# Altium project PCB_Project.PrjPcb
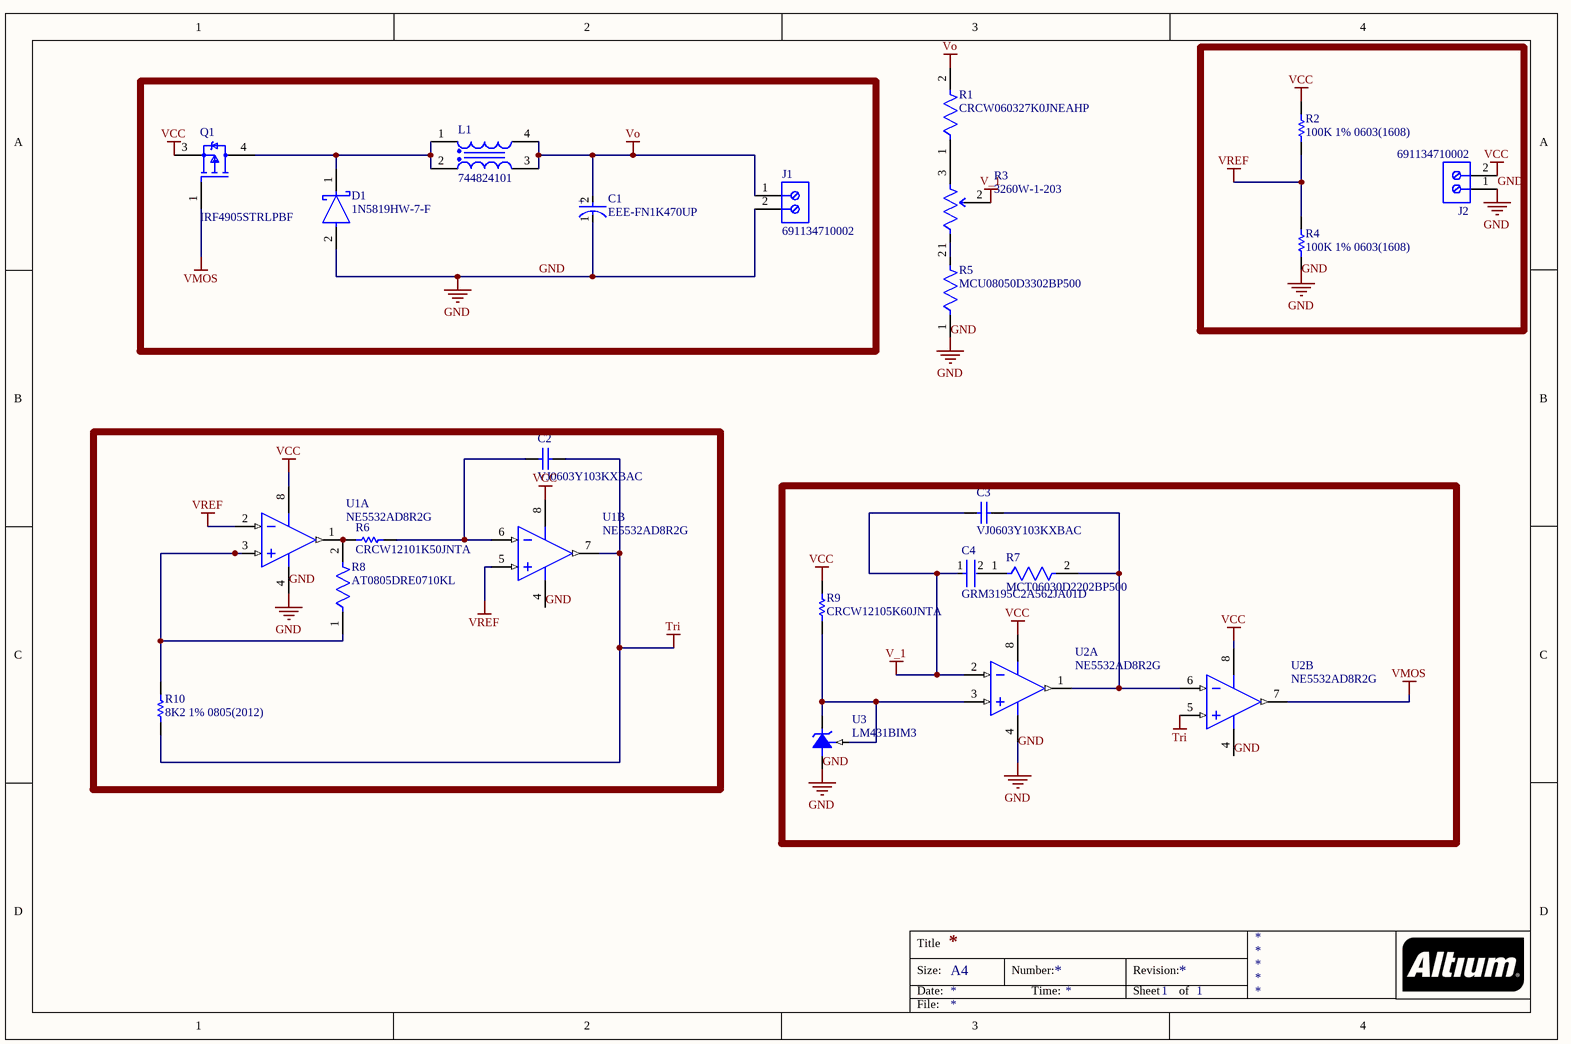
[diagram p0: Sheet1.SchDoc]
1 sheet, 22 parts. Net scope: global (net labels, ports and power ports of the same name join across sheets).
Board file: PCB1.PcbDoc

## Sheet Sheet1.SchDoc
size A4; Author: Senuda Ratnayake; SheetNumber: 1; SheetTotal: 1

### Parts
C1  EEE-FN1K470UP  [FP-FNF-MFG]
C2  VJ0603Y103KXBAC  [CAPC1608X92X38NL15T08]
C3  VJ0603Y103KXBAC  [CAPC1608X92X38NL15T08]
C4  GRM3195C2A562JA01D  [FP-GRM319-0_15-IPC_A]
D1  1N5819HW-7-F  [FP-SOD123-IPC_A]
J1  691134710002  [691134710002]
J2  691134710002  [691134710002]
L1  744824101  [WE-CMB_Type L_L27.5W18.5H33]
Q1  IRF4905STRLPBF  [FP-PG-TO263-3-MFG]
R1  CRCW060327K0JNEAHP  [FP-CRCW0603-HPe3-IPC_B]
R2  100K 1% 0603(1608)  [RESC0603(1608)_N]
R3  3260W-1-203  [FP-3260W-MFG]
R4  100K 1% 0603(1608)  [RESC0603(1608)_N]
R5  MCU08050D3302BP500  [FP-MCU0805-IPC_A]
R6  CRCW12101K50JNTA  [RESC3225X60X45NL20T20]
R7  MCT06030D2202BP500  [FP-MCT0603-IPC_A]
R8  AT0805DRE0710KL  [FP-AT0805-MFG]
R9  CRCW12105K60JNTA  [RESC3225X60X45LL20T20]
R10  8K2 1% 0805(2012)  [RESC0805(2012)_N]
U1  NE5532AD8R2G  [ONSC-SOIC-8-751-07_V]  (parts A,B of 2)
U2  NE5532AD8R2G  [ONSC-SOIC-8-751-07_V]  (parts A,B of 2)
U3  LM431BIM3  [DBZ0003A_M]

### Nets
GND: C1.1(C) D1.2(A) J1.2 J2.1 R4.1 R5.1 U1.4(V-) U2.4(V-) U3.3(A)
Tri: C2.2 R10.1 U1.7(OUTB) U2.5(INB+)
V_1: C3.1 C4.1 R3.2(WIPER) U2.2(INA-)
VCC: J2.2 Q1.3(S) R2.2 R9.2 U1.8(V+) U2.8(V+)
VMOS: Q1.1(G) U2.7(OUTB)
Vo: C1.2(A) J1.1 L1.3 L1.4 R1.2
VREF: R2.1 R4.2 U1.2(INA-) U1.5(INB+)
NetC2_1: C2.1 R6.2 U1.6(INB-)
NetC3_2: C3.2 R7.2 U2.1(OUTA) U2.6(INB-)
NetC4_2: C4.2 R7.1
NetD1_1: D1.1(C) L1.1 L1.2 Q1.4(D)
NetR1_1: R1.1 R3.3(CW)
NetR3_1: R3.1(CCW) R5.2
NetR6_1: R6.1 R8.2 U1.1(OUTA)
NetR8_1: R8.1 R10.2 U1.3(INA+)
NetR9_1: R9.1 U2.3(INA+) U3.1(K) U3.2(REF)

### Notes on the sheet
- Labels drawn without touching a wire or pin: GND
- Title
- Size:
- Date:
- A4
- Number:
- Time:
- Revision:
- Sheet
- of
- File:
- (in symbol CMP-05427-000046-1) +

### Library data of the parts
C1 = CMP-05427-000046-1: CAP ALUM 47UF 20% 80V SMD
C2 C3 = CMP-2006-01186-1: Manufacturer: Vitramon; Part Number: VJ0603Y103KXBAC
C4 = CMP-1037-03218-2: Chip Multilayer Ceramic Capacitors for General Purpose, 1206, 5600pF, C0G, 30ppm/°C, 5%, 100V; Capacitance: 5.6nF; Width: 1.6mm; Tolerance: 5%; Length: 3.2mm; Case/Package: 1206; Height: 0.85mm; Radiation Hardening: No; Voltage Rating: 100V; Mount: Surface Mount; Thickness: 0.037inch; Case Code (Metric): 3216; Lead Free: Lead Free; Case Code (Imperial): 1206; Voltage Rating (DC): 100V; Termination: SMD/SMT; Min Operating Temperature: -55°C; Package Quantity: 4000; Max Operating Temperature: 125°C; Dielectric: C0G; Packaging: Tape and Reel; Depth: 1.6mm
D1 = CMP-0303-00003-3: DIODE SCHOTTKY 40V 1A SOD123; Forward Voltage: 450mV; Capacitance: 110pF; Max Forward Surge Current (Ifsm): 25A; Peak Reverse Current: 50uA; Polarity: Standard; Element Configuration: Single; Max Power Dissipation: 450mW; Min Operating Temperature: -65°C; Package Quantity: 3000; Contact Plating: Tin; Weight: 0.000353oz; Max Repetitive Reverse Voltage (Vrrm): 40V; Max Reverse Voltage (DC): 40V; Height: 1.25mm; Average Rectified Current: 1A; Width: 1.7mm; Case/Package: SOD-123-2; Lead Free: Lead Free; Max Operating Temperature: 125°C; Current Rating: 1A; Termination: SMD/SMT; Forward Current: 1A; Radiation Hardening: No; Number of Pins: 2; Length: 2.85mm; Voltage Rating (DC): 40V; REACH SVHC: No SVHC; Peak Non-Repetitive Surge Current: 25A; Packaging: Tape and Reel; Output Current: 1A
J1 J2 = CMP-1502-03295-3: Wire-To-Board Terminal Block, 5mm Pitch, Horizontal, Screw, 2 Poles
L1 = CMP-0223-00095-2: NexarPartId: 22862926; Inductance: 1mH; Inductance Tolerance: 30%; Resistance: 7mΩ; RoHS: Compliant; Packaging: Bulk; Number of Pins: 4
Q1 = CMP-32901-000610-1: MOSFET P-CH 55V 42A D2PAK; Max Dual Supply Voltage: -55V; Max Power Dissipation: 170W; Rds On Max: 20mR; Input Capacitance: 3.5nF; Threshold Voltage: 4V; RoHS Compliant: Yes; Packaging: Tape and Reel; REACH SVHC: No SVHC; Continuous Drain Current (ID): 42A; Mount: Surface Mount; Drain to Source Voltage (Vdss): -55V; Max Operating Temperature: 150°C; Number of Pins: 3; Lead Free: Contains Lead; Case/Package: TO-263-3; Min Operating Temperature: -55°C; Halogen Free: Halogen Free
R1 = CMP-02407-002948-1: RES Thick Film, 27kΩ, 5%, 0.33W, 200ppm/°C, 0603; Resistance: 27kR; Max Power Dissipation: 250mW; Composition: Thick Film; Length: 0.063inch; Packaging: Tape and Reel; Features: Automotive AEC-Q200; Case/Package: 0603; Temperature Coefficient: 200ppm/°C; Number of Terminations: 2; Lead Free: Lead Free; Height: 0.022inch; Tolerance: 5%; Width: 0.033inch; Package Quantity: 5000
R2 R4 = CMP-1012-00736-1: 100K 0.1W 1% 0603 (1608 Metric)  SMD; Value: 100000.00 Ohm; Case-Metric: 1608; Case-EIA: 0603; Power: 0.1 W; Tolerance: 1 %; Technology: SMT
R3 = CMP-00059-01030895-1: 3260W-1-203 Resistor Trimmer, Wirewound, 20 kOhm, ± 5%, 250 mW, 11 Turn, Multi Turn, Through Hole; Max Power Dissipation: 250mW; Number of Turns: 11; Voltage Rating (DC): 500V; Resistance: 20kΩ; Temperature Coefficient: 70ppm/°C; Length: 6.35mm; Depth: 4.32mm; RoHS: Compliant; Radiation Hardening: No; Min Operating Temperature: -65°C; Mount: Panel, Through Hole; Military Standard: Not; Termination: Pin; Schedule B: 8533310000; NexarPartId: 1030895; Max Operating Temperature: 150°C; Packaging: Bulk; Power Rating: 250mW; Composition: Wirewound; Width: 2.54mm; Taper: Linear; Weight: 425.242847mg; Tolerance: 5%; Height: 6.35mm
R5 = CMP-02407-004085-1: RES 1.05K OHM 0.5% 1/5W 0805; Tolerance: 0.1%; Resistance: 33000R; Width: 1.25mm; Height: 450um; Length: 2mm; Lead Free: Lead Free; Case/Package: 0805
R6 = CMP-2005-00722-1: Manufacturer: Vishay Dale; Part Number: CRCW12101K50JNTA
R7 = CMP-02407-001201-1: RES SMD 100 OHM 1% 1/8W 0603; Resistance: 22kR; Max Power Dissipation: 100mW; Tolerance: 0.1%; Temperature Coefficient: 25ppm/°C; Height: 0.022inch; Radiation Hardening: No; Width: 0.033inch; Packaging: Tape and Reel; Composition: Thin Film; Military Standard: Not; Length: 0.061inch; Case/Package: 0603; Lead Free: Lead Free; Package Quantity: 5000; Min Operating Temperature: -55°C; Max Operating Temperature: 125°C; Contact Plating: Tin; Number of Terminations: 2; Depth: 0.85mm
R8 = CMP-03412-049031-1: Thin Film Chip Resistors Automotive Grade 10kΩ 0.5% 50ppm/°C 0805; Max Power Dissipation: 125mW; Resistance: 10kR; Ratings: AEC-Q200; Length: 0.079inch; Temperature Coefficient: 50ppm/°C; Height: 0.024inch; Min Operating Temperature: -55°C; Case/Package: 0805; Tolerance: 0.5%; RoHS Compliant: Yes; Features: Moisture Resistant; Number of Terminations: 2; Max Operating Temperature: 155°C; Series: AT; Packaging: Tape and Reel; Width: 0.049inch; Resistor Type: Thin Film
R9 = CMP-2005-00740-1: Manufacturer: Vishay Dale; Part Number: CRCW12105K60JNTA
R10 = CMP-1013-00613-1: 8K2 0.125W 1% 0805 (2012 Metric)  SMD; Value: 8200.00 Ohm; Case-EIA: 0805; Case-Metric: 2012; Power: 0.125 W; Tolerance: 1 %; Technology: SMT
U1 U2 = CMP-1310-00252-1: Internally Compensated Dual Low Noise Operational Amplifier, 6 to 40 V, 0 to 70 degC, 8-Pin SOIC, Pb-Free, Tape and Reel; Manufacturer: On Semiconductor; SR Typ (V/uS): 9; VCC Min (V): 6; VCC Max (V): 40; GBW Typ (MHz): 10; PackageVersion: Rev. AK, 02/2011; ComponentLink2URL: http://www.onsemi.cn/pub_link/Collateral/NE5532-D.PDF; RoHS: TRUE; PackageReference: SOIC-8-751-07; ComponentLink2Description: Datasheet; PackageDescription: 8-Pin Small Outline Integrated Circuit, Body 4.9 x 3.9 mm, Pitch 1.27 mm; ComponentLink3URL: http://www.onsemi.com/pub_link/Collateral/751-07.PDF; ComponentLink1Description: Manufacturer URL; DatasheetVersion: Rev. 2; Packing: Tape and Reel; ComponentLink1URL: http://www.onsemi.com/; ComponentLink3Description: Package Specification; Mounting Technology: Surface Mount; PartNumber: NE5532AD8R2G
U3 = CMP-0063-01142-3: Adjustable Precision Zener Shunt Regulator, 3-pin SOT-23; Manufacturer: Texas Instruments; PowerWise: N; PackageTopMarking: N1C*XTT; CompType: MiscPower; PackageReference: DBZ0003A; PinCount: 3; RoHS: N; ComponentLink1URL: http://www.ti.com/general/docs/lit/getliterature.tsp?genericPartNumber=LM431&fileType=pdf; ComponentLink1Description: Datasheet URL; PackageDescription: Molded SOT-23, .115 x .051 x .037in Body, 3 Lead, .075 in Pitch